# EAGLE schematic orajel (EAGLE 6.4)
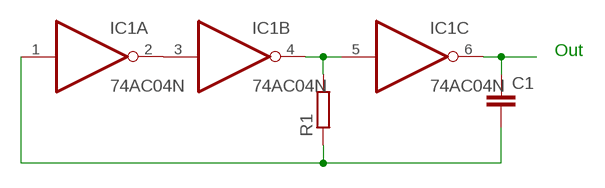
[diagram p0: schematic, sheet 1]

## Parts
C1  C-EU025-030X050  [C025-030X050]
IC1  74AC04N  [DIL14]
R1  R-EU_0207/12  [0207/12]

## Nets
N$1: IC1.2(A:O) IC1.3(B:I)
N$2: IC1.4(B:O) IC1.5(C:I) R1.2
N$3: C1.2 IC1.1(A:I) R1.1
N$4: C1.1 IC1.6(C:O)
Unconnected: IC1.8(D:O) IC1.9(D:I) IC1.10(E:O) IC1.11(E:I) IC1.12(F:O) IC1.13(F:I)

## Notes on the sheet
- Out

## Power pins joined to a net without a drawn wire
GND: IC1.7(P:GND)
VCC: IC1.14(P:VCC)

## Library data of the parts
C1 = rcl:C-EU: CAPACITOR, European symbol
IC1 = 74xx-eu:74*04: Hex INVERTER
R1 = rcl:R-EU_: RESISTOR, European symbol